# EAGLE design teensy_toslink_v1.2 (EAGLE 9.5.2)
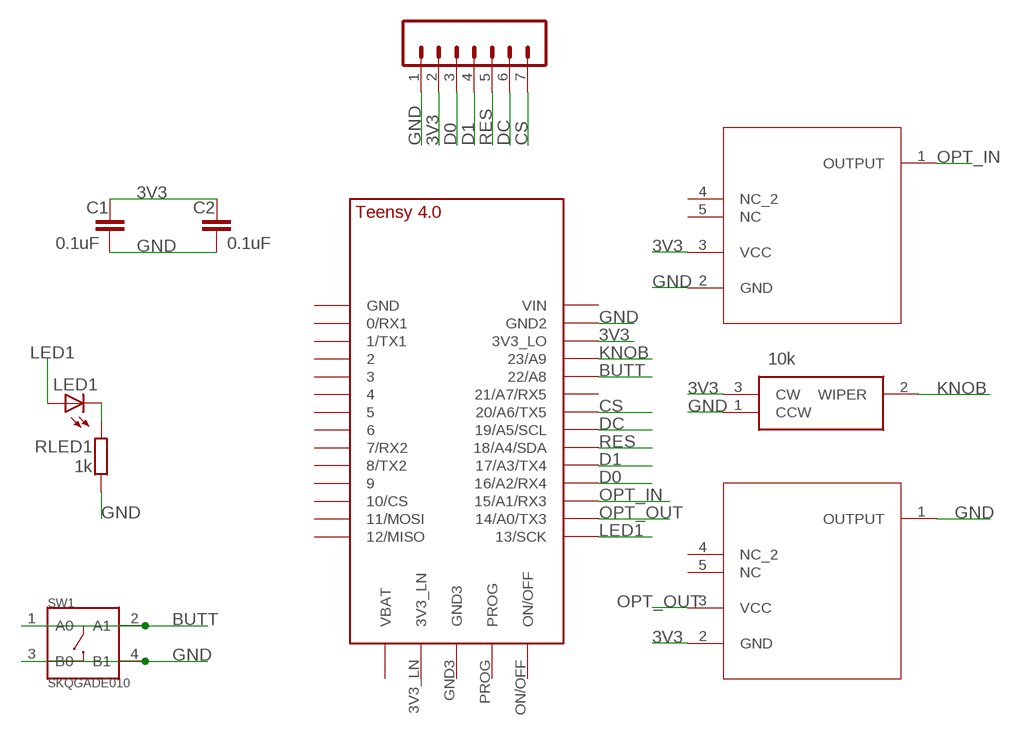
[diagram p0: schematic, sheet 1]

## Parts
C1  0.1uF  C-EUC0805  [C0805]
C2  0.1uF  C-EUC0805  [C0805]
CN1  8p-2.54  CONN_07  [1X07]
J1  TORX141P(F)TORX141P(F)_TOS  [TORX141P(F)_TOS]
J2  TORX141P(F)TORX141P(F)_TOS  [TORX141P(F)_TOS]
LED1  0805  LEDCHIPLED_0805  [CHIPLED_0805]
RLED1  1k  R-EU_R0805  [R0805]
SW1  SKQGADE010  SMD-BUTTON(4P-5.2X5.2X1.5MM-SKQGADE010)-SKQGADE010  [SW4-SMD-5.2X5.2X1.5MM]
U$1  TEENSY_4.0  [TEENSY_4.0]
VR1  10k  3386P-1-103  [3386P1103TLF]

## Nets
3V3 [power]: C1.1 C2.1 CN1.2 J1.3(VCC) J2.2(GND) U$1.3V3_LO VR1.3(CW)
BUTT: SW1.1(A0) SW1.2(A1) U$1.22/A8
CS: CN1.7 U$1.20/A6(20/A6/TX5)
D0: CN1.3 U$1.16/A2(16/A2/RX4)
D1: CN1.4 U$1.17/A3(17/A3/TX4)
DC: CN1.6 U$1.19/A5/SCL
GND [power]: C1.2 C2.2 CN1.1 J1.2(GND) J2.1(OUTPUT) RLED1.1 SW1.3(B0) SW1.4(B1) U$1.GND2 VR1.1(CCW)
KNOB: U$1.23/A9 VR1.2(WIPER)
LED1: LED1.A U$1.13/SCK
N$8: LED1.C RLED1.2
OPT_IN: J1.1(OUTPUT) U$1.15/A1(15/A1/RX3)
OPT_OUT: J2.3(VCC) U$1.14/A0(14/A0/TX3)
RES: CN1.5 U$1.18/A4/SDA
Unconnected: J1.4(NC_2) J1.5(NC) J2.4(NC_2) J2.5(NC) U$1.0/RX(0/RX1) U$1.1/TX(1/TX1) U$1.2 U$1.3/CANTX U$1.3V3_LN U$1.4/CANRX U$1.5 U$1.6 U$1.7(7/RX2) U$1.8(8/TX2) U$1.9/CS U$1.10/CS U$1.11/MOSI U$1.12/MISO U$1.21/A7(21/A7/RX5) U$1.GND U$1.GND3 U$1.ON/OFF U$1.PROG U$1.VBAT\(VBAT) U$1.VIN

## Library data of the parts
C1 C2 = resistor:C-EU: CAPACITOR, European symbol
CN1 = SparkFun-Connectors:CONN_07: Multi connection point. Often used as Generic Header-pin footprint for 0.1 inch spaced/style header connections On any of the 0.1 inch spaced packages, you can populate with these: Break Away Headers - Straight <https://www.sparkfun.com/products/116> (PRT-00116) Break Away Male Headers - Right Angle <https://www.sparkfun.com/products/553> (PRT-00553) Female Headers <https://www.sparkfun.com/products/115> (PRT-00115) Break Away Headers - Machine Pin <https://www.sparkfun.com/products/117> (PRT-00117) Break Away Female Headers - Swiss Machine Pin <https://www.sparkfun.com/products/743> (PRT-00743) For SCREWTERMINALS and SPRING TERMINALS visit here: Screw Terimnals on SparkFun.com <https://www.sparkfun.com/search/results?term=Screw+Terminals> (5mm/3.5mm/2.54mm spacing) This device is also useful as a general connection point to wire up your design to another part of your project. Our various solder wires solder well into these plated through hole pads. Hook-Up Wire - Assortment (Stranded, 22 AWG) <https://www.sparkfun.com/products/11375> (PRT-11375) Hook-Up Wire - Assortment (Solid Core, 22 AWG) <https://www.sparkfun.com/products/11367> (PRT-11367) View the entire wire category on our website here <https://www.sparkfun.com/categories/141> Special notes: Molex polarized connector foot print use with SKU : PRT-08231 with associated crimp pins and housings. 1MM SMD Version SKU: PRT-10208 NOTES ON THE VARIANTS LOCK and LOCK_LONGPADS... This footprint was designed to help hold the alignment of a through-hole component (i.e. 6-pin header) while soldering it into place. You may notice that each hole has been shifted either up or down by 0.005 of an inch from it's more standard position (which is a perfectly straight line). This slight alteration caused the pins (the squares in the middle) to touch the edges of the holes. Because they are alternating, it causes a "brace" to hold the component in place. 0.005 has proven to be the perfect amount of "off-center" position when using our standard breakaway headers. Although looks a little odd when you look at the bare footprint, once you have a header in there, the alteration is very hard to notice. Also,if you push a header all the way into place, it is covered up entirely on the bottom side.
J1 J2 = toslink:TORX141P(F); COPYRIGHT: Copyright (C) 2023 Ultra Librarian. All rights reserved.; MANUFACTURER_PART_NUMBER: TORX141P(F); MFR_NAME: Toshiba Electronic Devices & Storage Corp.
LED1 = led:LED: LED OSRAM: - CHIPLED LG R971, LG N971, LY N971, LG Q971, LY Q971, LO R971, LY R971 LH N974, LH R974 LS Q976, LO Q976, LY Q976 LO Q996 - Hyper CHIPLED LW Q18S LB Q993, LB Q99A, LB R99A - SideLED LS A670, LO A670, LY A670, LG A670, LP A670 LB A673, LV A673, LT A673, LW A673 LH A674 LY A675 LS A676, LA A676, LO A676, LY A676, LW A676 LS A679, LY A679, LG A679 - Hyper Micro SIDELED® LS Y876, LA Y876, LO Y876, LY Y876 LT Y87S - SmartLED LW L88C, LW L88S LB L89C, LB L89S, LG L890 LS L89K, LO L89K, LY L89K LS L896, LA L896, LO L896, LY L896 - TOPLED LS T670, LO T670, LY T670, LG T670, LP T670 LSG T670, LSP T670, LSY T670, LOP T670, LYG T670 LG T671, LOG T671, LSG T671 LB T673, LV T673, LT T673, LW T673 LH T674 LS T676, LA T676, LO T676, LY T676, LB T676, LH T676, LSB T676, LW T676 LB T67C, LV T67C, LT T67C, LS T67K, LO T67K, LY T67K, LW E67C LS E67B, LA E67B, LO E67B, LY E67B, LB E67C, LV E67C, LT E67C LW T67C LS T679, LY T679, LG T679 LS T770, LO T770, LY T770, LG T770, LP T770 LB T773, LV T773, LT T773, LW T773 LH T774 LS E675, LA E675, LY E675, LS T675 LS T776, LA T776, LO T776, LY T776, LB T776 LHGB T686 LT T68C, LB T68C - Hyper Mini TOPLED® LB M676 - Mini TOPLED Santana® LG M470 LS M47K, LO M47K, LY M47K Source: http://www.osram.convergy.de LUXEON: - LUMILED® LXK2-PW12-R00, LXK2-PW12-S00, LXK2-PW14-U00, LXK2-PW14-V00 LXK2-PM12-R00, LXK2-PM12-S00, LXK2-PM14-U00 LXK2-PE12-Q00, LXK2-PE12-R00, LXK2-PE12-S00, LXK2-PE14-T00, LXK2-PE14-U00 LXK2-PB12-K00, LXK2-PB12-L00, LXK2-PB12-M00, LXK2-PB14-N00, LXK2-PB14-P00, LXK2-PB14-Q00 LXK2-PR12-L00, LXK2-PR12-M00, LXK2-PR14-Q00, LXK2-PR14-R00 LXK2-PD12-Q00, LXK2-PD12-R00, LXK2-PD12-S00 LXK2-PH12-R00, LXK2-PH12-S00 LXK2-PL12-P00, LXK2-PL12-Q00, LXK2-PL12-R00 Source: www.luxeon.com KINGBRIGHT: KA-3528ASYC Source: www.kingbright.com
RLED1 = rcl:R-EU_: RESISTOR, European symbol
SW1 = Seeed-Switch:SMD-BUTTON(4P-5.2X5.2X1.5MM-SKQGADE010): 311020017; MPN: SKQGADE010
U$1 = TEENSY 4.0:TEENSY_4.0
VR1 = 3386P-1-103:3386P-1-103: Trimmer Resistors - Through Hole 3/8"SQ 10KOHMS 10% 0.5WATTS Source: Datasheet; DESCRIPTION: Trimmer Resistors - Through Hole 3/8"SQ 10KOHMS 10% 0.5WATTS; HEIGHT: 4.83mm; MANUFACTURER_NAME: Bourns; MANUFACTURER_PART_NUMBER: 3386P-1-103; MOUSER_PART_NUMBER: 652-3386P-1-103; MOUSER_PRICE-STOCK: https://www.mouser.co.uk/ProductDetail/Bourns/3386P-1-103?qs=8ovTl4njQkUNVfkrJ%252Bl%2Fgw%3D%3D

## Net classes
0 default: width 0.406 mm, clearance 0.203 mm
1 power: width 0.508 mm, clearance 0.203 mm

## Board
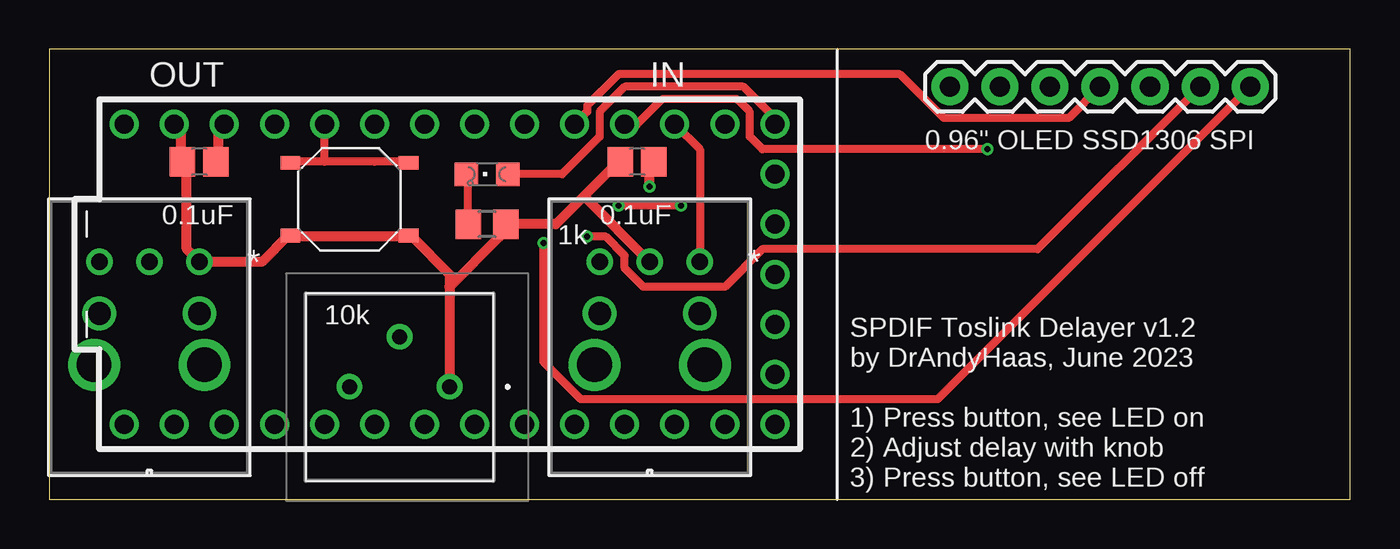
[diagram p1: board, top side]
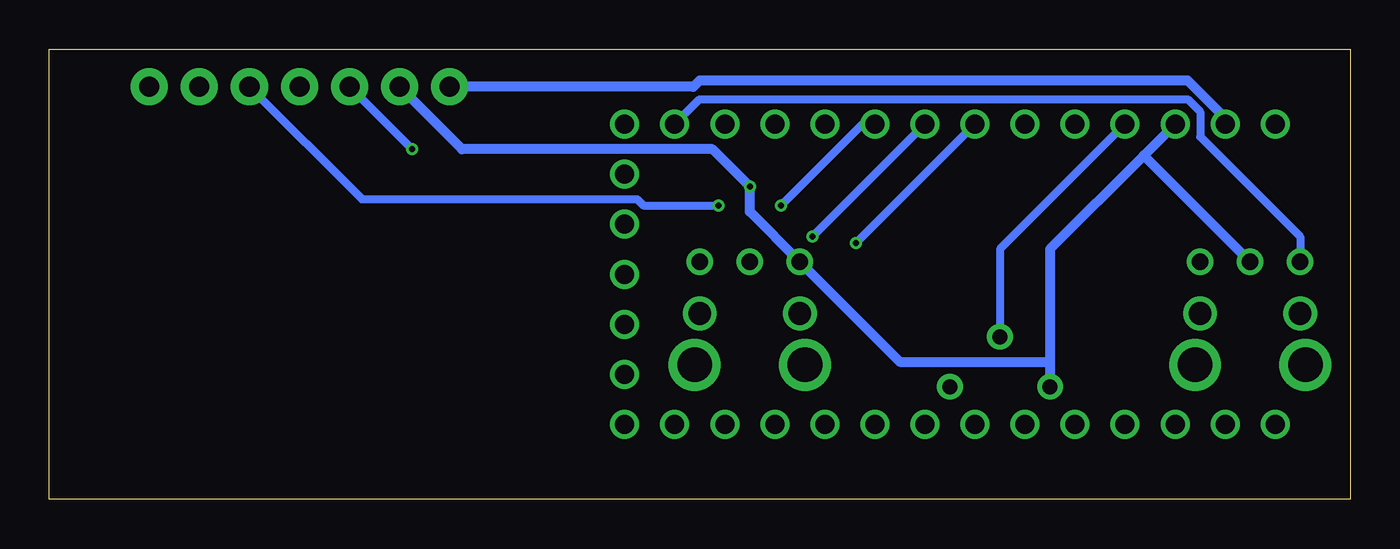
[diagram p2: board, bottom side, seen from below]

Size 66.04 x 22.86 mm. Coordinates in mm from the lower left corner, seen from the top.
Outline: 0,22.86 0,0 66.04,0 66.04,22.86 0,22.86
Copper layers (1*16): Top 0.035mm / dielectric 1.5mm / Bottom 0.035mm
Design rules "Fusion_eagle_rule_v1.1": minimum track width 6mil, minimum drill 12mil, track to track 6mil, track to pad 6mil, pad to pad 6mil, via to via 6mil, smd to smd 0mil, copper to edge 10mil, drill to drill 10mil, minimum pad ring 10mil, minimum via ring 6mil, stop-mask expansion 2mil, vias tented up to drill 100mil, thermal gap 10mil
vRestrict: area 31.8,17.8 to 36.8,21.6

### Footprints (pad centres in the part's own frame; a part is rotated, then mirrored left to right if it is on the bottom)
C0805 = smd 1.3 x 1.5: 1 -0.85,0; 2 0.85,0
1X07 = drill 1.016 pad 1.88: 1 0,0; 2 2.54,0; 3 5.08,0; 4 7.62,0; 5 10.16,0; 6 12.7,0; 7 15.24,0
TORX141P(F)_TOS = drill 0.838 pad 1.346: 1 0,0; 2 2.54,0; 3 5.08,0 | drill 1.143 pad 1.651: 4 0,2.625; 5 5.08,2.625 | drill 1.753 pad 1.753: 6 -0.26,5.235; 7 5.34,5.235
CHIPLED_0805 = smd 1.2 x 1.2: A 0,-1.05; C 0,1.05
R0805 = smd 1.3 x 1.5: 1 -0.95,0; 2 0.95,0
SW4-SMD-5.2X5.2X1.5MM = smd 1 x 0.7: 1 -3,1.85; 2 3,1.85; 3 -3,-1.85; 4 3,-1.85
TEENSY_4.0 = drill 0.965: 0/RX -13.97,-7.62; 1/TX -11.43,-7.62; 2 -8.89,-7.62; 3/CANTX -6.35,-7.62; 3V3_LN 16.51,-2.54; 3V3_LO -11.43,7.62; 4/CANRX -3.81,-7.62; 5 -1.27,-7.62; 6 1.27,-7.62; 7 3.81,-7.62; 8 6.35,-7.62; 9/CS 8.89,-7.62; 10/CS 11.43,-7.62; 11/MOSI 13.97,-7.62; 12/MISO 16.51,-7.62; 13/SCK 16.51,7.62; 14/A0 13.97,7.62; 15/A1 11.43,7.62; 16/A2 8.89,7.62; 17/A3 6.35,7.62; 18/A4/SDA 3.81,7.62; 19/A5/SCL 1.27,7.62; 20/A6 -1.27,7.62; 21/A7 -3.81,7.62; 22/A8 -6.35,7.62; 23/A9 -8.89,7.62; GND -16.51,-7.62; GND2 -13.97,7.62; GND3 16.51,0; ON/OFF 16.51,5.08; PROG 16.51,2.54; VBAT\ 16.51,-5.08; VIN -16.51,7.62
3386P1103TLF = drill 0.76 pad 1.303: 1 0,0; 2 -2.54,2.54; 3 -5.08,0

### Placement (x,y rotation side)
C1  7.62,17.14 180 top
C2  29.84,17.14 180 top
CN1  45.72,20.95 0 top
J1  33.02,12.07 180 top
J2  7.62,12.07 180 top
LED1  22.22,16.51 90 top
RLED1  22.22,13.97 180 top
SW1  15.24,15.24 0 top
U$1  20.32,11.43 0 top
VR1  20.32,5.71 0 top

### Tracks (layer width: path | path; a pad name or v marks a point on that pad's centre or on a via)
3V3  (via drill 0.3)
  Top 0.508: U$1.3V3_LO 8.57,18.73 8.57,17.14 C1.1 | v30.48,15.88 30.48,17.14 C2.1
  Bottom 0.508: 15.24,6.99 15.24,12.7 10.48,17.46 | 15.24,6.99 VR1.3 | U$1.3V3_LO 10.48,17.46 | 10.48,17.46 J2.2 | CN1.2 45.09,17.78 32.38,17.78 v30.48,15.88 30.48,14.61 J1.3 22.86,6.99 15.24,6.99
BUTT
  Top 0.406: 13.97,17.14 16.51,17.14 18.1,17.14 SW1.2 | 13.97,17.14 12.38,17.14 SW1.1 | 13.97,17.14 U$1.22/A8
CS  (via drill 0.3)
  Top 0.406: v25.08,13.02 25.08,6.99 26.99,5.08 45.09,5.08 CN1.7
  Bottom 0.406: v25.08,13.02 U$1.20/A6
D0  (via drill 0.3)
  Top 0.406: U$1.16/A2 29.84,19.05 31.11,20.32 34.92,20.32 35.56,19.68 35.56,18.41 36.2,17.78 v47.62,17.78
  Bottom 0.406: CN1.3 v47.62,17.78
D1
  Top 0.406: U$1.17/A3 27.3,19.68 27.3,20 28.89,21.59 43.18,21.59 45.4,19.37 51.75,19.37 CN1.4
DC  (via drill 0.3)
  Top 0.406: v27.3,13.34 28.26,13.34 29.21,12.38 29.21,11.75 30.16,10.8 34.29,10.8 36.2,12.7 50.16,12.7 CN1.6
  Bottom 0.406: v27.3,13.34 U$1.19/A5/SCL
GND
  Top 0.508: 27.15,15.4 28.89,17.14 C2.2 | 27.15,15.4 25.72,13.97 RLED1.1 22.86,13.97 22.86,13.34 20.32,10.8 | 27.15,15.4 J1.2 | U$1.GND2 6.67,18.73 6.67,17.14 C1.2 6.99,17.14 6.99,12.7 J2.1 10.8,12.07 12.07,13.34 SW1.3 12.38,13.34 18.1,13.34 SW1.4 18.41,13.34 20.32,11.43 20.32,10.8 | 20.32,10.8 VR1.1
  Bottom 0.508: CN1.1 33.34,20.95 33.02,21.27 8.25,21.27 6.35,19.37 U$1.GND2
KNOB
  Bottom 0.406: VR1.2 17.78,12.7 U$1.23/A9
LED1
  Top 0.406: LED1.A 26.04,16.51 27.94,18.41 27.94,19.68 29.21,20.95 35.24,20.95 36.83,19.37 U$1.13/SCK
N$8
  Top 0.406: LED1.C 21.27,16.51 RLED1.2
OPT_IN
  Top 0.406: J1.1 33.02,17.78 U$1.15/A1
OPT_OUT
  Bottom 0.406: J2.3 2.54,13.34 7.62,18.41 7.62,19.68 8.25,20.32 33.02,20.32 U$1.14/A0
RES  (via drill 0.3)
  Top 0.406: v32.07,14.92 v28.89,14.92
  Bottom 0.406: U$1.18/A4/SDA 24.77,19.05 v28.89,14.92 | v32.07,14.92 35.88,14.92 36.2,15.24 50.16,15.24 CN1.5

### Text on the board
tPlace: OUT | IN | 0.96" OLED SSD1306 SPI | 0.1uF | 0.1uF | 10k | SPDIF Toslink Delayer v1.2 / by DrAndyHaas, June 2023 / / 1) Press button, see LED on / 2) Adjust delay with knob / 3) Press button, see LED off